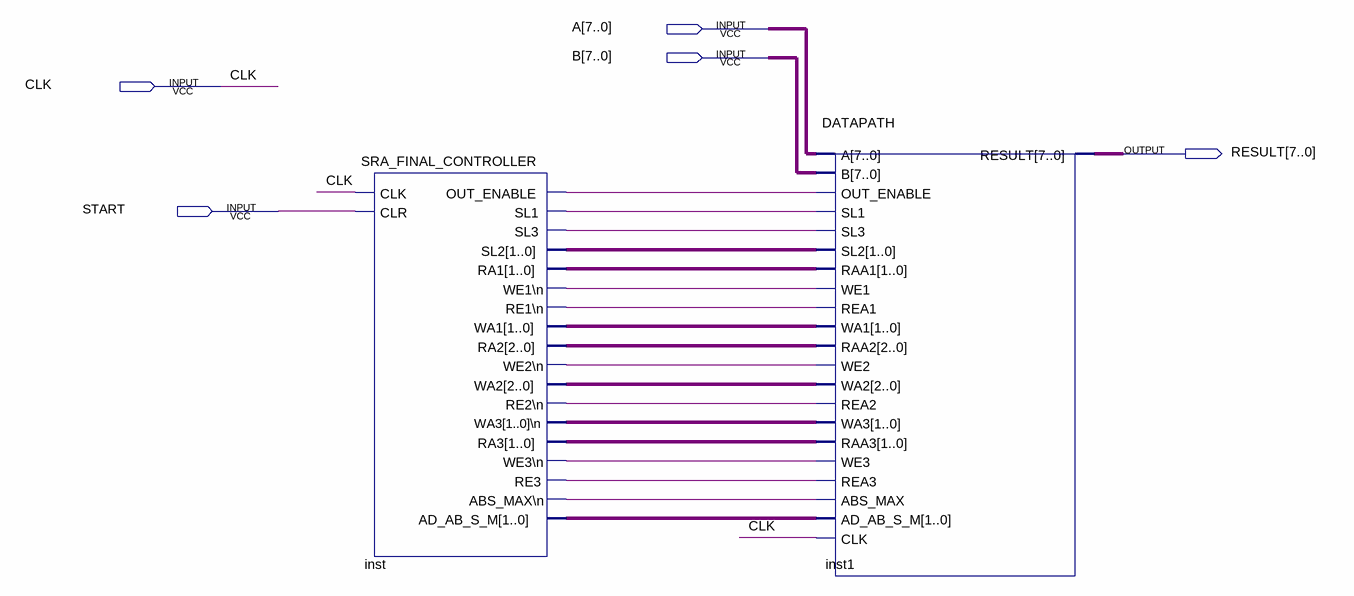
[diagram p0: schematic sheet]
// Quartus schematic SRA_FINAL.bdf as structural Verilog: 2 symbols, 5 pins
module SRA_FINAL (
  input  [7:0] A,
  input  [7:0] B,
  input  CLK,
  input  START,
  output [7:0] RESULT
);

  wire inst_abs_max_n, inst_out_enable, inst_re1_n, inst_re2_n, inst_re3, inst_sl1, inst_sl3, inst_we1_n,
       inst_we2_n, inst_we3_n;
  wire [1:0] inst_ad_ab_s_m, inst_ra1, inst_ra3, inst_sl2, inst_wa1, inst_wa3_1__0__n;
  wire [2:0] inst_ra2, inst_wa2;

  SRA_FINAL_CONTROLLER inst (
    .CLK(CLK), .CLR(START), .OUT_ENABLE(inst_out_enable), .SL1(inst_sl1), .SL3(inst_sl3), .SL2(inst_sl2),
    .RA1(inst_ra1), .\WE1\n (inst_we1_n), .\RE1\n (inst_re1_n), .WA1(inst_wa1), .RA2(inst_ra2),
    .\WE2\n (inst_we2_n), .WA2(inst_wa2), .\RE2\n (inst_re2_n), .\WA3[1..0]\n (inst_wa3_1__0__n),
    .RA3(inst_ra3), .\WE3\n (inst_we3_n), .RE3(inst_re3), .\ABS_MAX\n (inst_abs_max_n),
    .AD_AB_S_M(inst_ad_ab_s_m));
  DATAPATH inst1 (
    .A(A), .B(B), .OUT_ENABLE(inst_out_enable), .SL1(inst_sl1), .SL3(inst_sl3), .SL2(inst_sl2),
    .WA1(inst_wa1), .RAA1(inst_ra1), .WE1(inst_we1_n), .REA1(inst_re1_n), .WA2(inst_wa2), .RAA2(inst_ra2),
    .WE2(inst_we2_n), .REA2(inst_re2_n), .WA3(inst_wa3_1__0__n), .RAA3(inst_ra3), .WE3(inst_we3_n),
    .REA3(inst_re3), .CLK(CLK), .ABS_MAX(inst_abs_max_n), .AD_AB_S_M(inst_ad_ab_s_m), .RESULT(RESULT));
endmodule
